# EAGLE design OSO-TIBO-B2-00 (EAGLE 9.6.2)

## Sheet 1 of 2
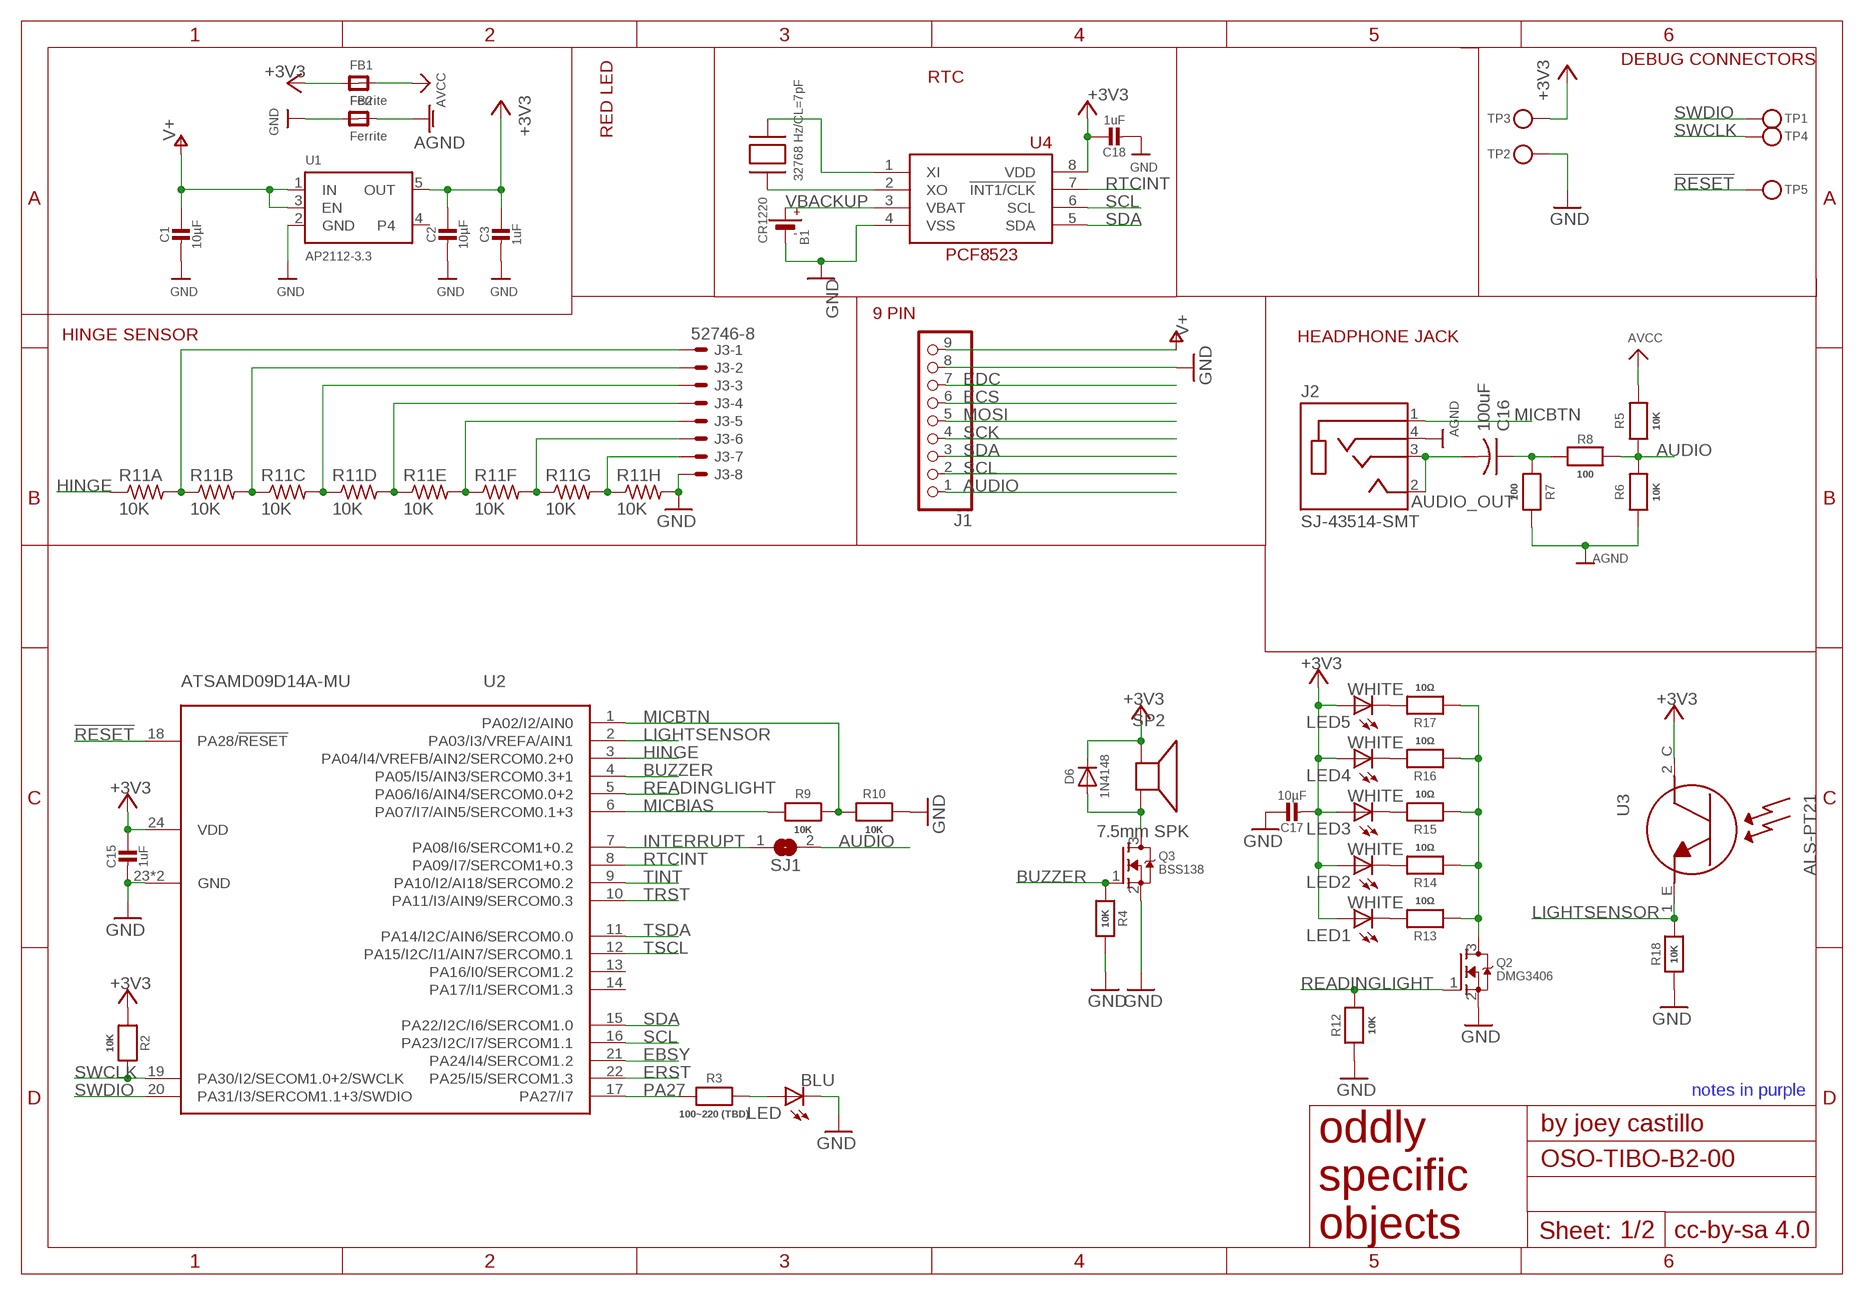
[diagram p0: schematic, sheet 1]

### Parts
B1  CR1220  BATTERYCR1220_SMT  [CR1220]
C1  10µF  CAP_CERAMIC0805-NOOUTLINE  [0805-NO]
C2  10µF  CAP_CERAMIC0805-NOOUTLINE  [0805-NO]
C3  1uF  CAP_CERAMIC0805-NOOUTLINE  [0805-NO]
C15  1uF  CAP_CERAMIC0805-NOOUTLINE  [0805-NO]
C16  100uF  C-USC1210  [C1210]
C17  10µF  CAP_CERAMIC0805-NOOUTLINE  [0805-NO]
C18  1uF  CAP_CERAMIC0805-NOOUTLINE  [0805-NO]
D6  1N4148  DIODESOD-123  [SOD-123]
FB1  Ferrite  FERRITE0805  [0805]
FB2  Ferrite  FERRITE0805  [0805]
J1  HEADER-1X9_JSTSH  [JST_SH9]
J2  SJ-43514-SMT  [CUI_SJ-43514-SMT]
J3  52746-8  [52746-8]
LED  BLU  LEDCHIPLED_0805  [CHIPLED_0805]
LED1  WHITE  LEDCHIPLED_0805  [CHIPLED_0805]
LED2  WHITE  LEDCHIPLED_0805  [CHIPLED_0805]
LED3  WHITE  LEDCHIPLED_0805  [CHIPLED_0805]
LED4  WHITE  LEDCHIPLED_0805  [CHIPLED_0805]
LED5  WHITE  LEDCHIPLED_0805  [CHIPLED_0805]
Q2  DMG3406  MOSFET-NWIDE  [SOT23-WIDE]
Q3  BSS138  MOSFET-NWIDE  [SOT23-WIDE]
R2  10K  RESISTOR0805_NOOUTLINE  [0805-NO]
R3  100~220 (TBD)  RESISTOR0805_NOOUTLINE  [0805-NO]
R4  10K  RESISTOR0805_NOOUTLINE  [0805-NO]
R5  10K  RESISTOR_0805MP  [_0805MP]
R6  10K  RESISTOR_0805MP  [_0805MP]
R7  100  RESISTOR_0805MP  [_0805MP]
R8  100  RESISTOR_0805MP  [_0805MP]
R9  10K  RESISTOR0805_NOOUTLINE  [0805-NO]
R10  10K  RESISTOR0805_NOOUTLINE  [0805-NO]
R11  10K  EXB-2HV470JV  [EXB2HV]
R12  10K  RESISTOR0805_NOOUTLINE  [0805-NO]
R13  10Ω  RESISTOR0805_NOOUTLINE  [0805-NO]
R14  10Ω  RESISTOR0805_NOOUTLINE  [0805-NO]
R15  10Ω  RESISTOR0805_NOOUTLINE  [0805-NO]
R16  10Ω  RESISTOR0805_NOOUTLINE  [0805-NO]
R17  10Ω  RESISTOR0805_NOOUTLINE  [0805-NO]
R18  10K  RESISTOR0805_NOOUTLINE  [0805-NO]
SJ1  SOLDERJUMPERREFLOW_NOPASTE  [SOLDERJUMPER_REFLOW_NOPASTE]
SP2  7.5mm SPK  SPEAKER_BUZZER5MM  [BUZZER_SMT_5MM]
TP1  TESTPOINTROUND2MMNO  [TESTPOINT_ROUND_2MM_NO]
TP2  TESTPOINTROUND2MMNO  [TESTPOINT_ROUND_2MM_NO]
TP3  TESTPOINTROUND2MMNO  [TESTPOINT_ROUND_2MM_NO]
TP4  TESTPOINTROUND2MMNO  [TESTPOINT_ROUND_2MM_NO]
TP5  TESTPOINTROUND2MMNO  [TESTPOINT_ROUND_2MM_NO]
U1  AP2112-3.3  VREG_SOT23-5  [SOT23-5]
U2  ATSAMD09D14A-MU  [QFN24_4MM]
U3  ALS-PT21  PHOTOTRANSISTOR_PT26-21C  [ALS-PT26-21C]
U4  PCF8523T  RTC_PCF8523T  [SOIC8_150MIL]
X1  32768 Hz/CL=7pF  XTAL-3.2X1.5  [XTAL3215]

### Nets
!RESET: TP5.P$1 U2.18(PA28/!RESET)
+3V3 [power]: C2.1 C3.1 C15.1 C17.2 C18.1 D6.C FB1.1 LED1.A LED2.A LED3.A LED4.A LED5.A R2.1 SP2.- TP3.P$1 U1.5(OUT) U2.24(VDD) U3.2_C(C) U4.8(VDD) ; also sheet 2
AGND: FB2.2 J2.4(RING2) R6.2 R7.1
AUDIO: J1.1 R5.2 R6.1 R8.1 SJ1.2
AUDIO_OUT: C16.2 J2.2(TIP) J2.3(RING1)
AVCC: FB1.2 R5.1
BUZZER: Q3.1(G) R4.1 U2.4(PA05/I5/AIN3/SERCOM0.3+1)
EBSY: U2.21(PA24/I4/SERCOM1.2) ; also sheet 2
ECS: J1.6 ; also sheet 2
EDC: J1.7 ; also sheet 2
ERST: U2.22(PA25/I5/SERCOM1.3) ; also sheet 2
GND [gnd]: B1.- C1.2 C2.2 C3.2 C15.2 C17.1 C18.2 FB2.1 J1.8 J3.8 LED.C Q2.2(S) Q3.2(S) R4.2 R10.2 R11.9 R12.1 R18.1 TP2.P$1 U1.2(GND) U2.23(GND) U2.THERM(GND) U4.4(VSS) ; also sheet 2
HINGE: R11.1 U2.3(PA04/I4/VREFB/AIN2/SERCOM0.2+0)
INTERRUPT: SJ1.1 U2.7(PA08/I6/SERCOM1+0.2)
LIGHTSENSOR: R18.2 U2.2(PA03/I3/VREFA/AIN1) U3.1_E(E)
MICBIAS: R9.1 U2.6(PA07/I7/AIN5/SERCOM0.1+3)
MICBTN: J2.1(SLEEVE) R9.2 R10.1 U2.1(PA02/I2/AIN0)
MOSI: J1.5 ; also sheet 2
N$1: C16.1 R7.2 R8.2
N$4: LED1.C R13.2
N$5: J3.1 R11.2 R11.16
N$6: J3.2 R11.3 R11.15
N$7: LED.A R3.2
N$8: J3.3 R11.4 R11.14
N$9: J3.4 R11.5 R11.13
N$10: J3.5 R11.6 R11.12
N$11: J3.6 R11.7 R11.11
N$12: J3.7 R11.8 R11.10
N$13: D6.A Q3.3(D) SP2.+
N$14: LED2.C R14.2
N$15: LED3.C R15.2
N$16: LED4.C R16.2
N$18: LED5.C R17.2
PA27: R3.1 U2.17(PA27/I7)
READINGLIGHT: Q2.1(G) R12.2 U2.5(PA06/I6/AIN4/SERCOM0.0+2)
READINGLIGHT_SINK: Q2.3(D) R13.1 R14.1 R15.1 R16.1 R17.1
RTCINT: U2.8(PA09/I7/SERCOM1+0.3) U4.7(!INT1/CLK)
SCK: J1.4 ; also sheet 2
SCL: J1.2 U2.16(PA23/I2C/I7/SERCOM1.1) U4.6(SCL)
SDA: J1.3 U2.15(PA22/I2C/I6/SERCOM1.0) U4.5(SDA)
SWCLK: R2.2 TP4.P$1 U2.19(PA30/I2/SECOM1.0+2/SWCLK)
SWDIO: TP1.P$1 U2.20(PA31/I3/SERCOM1.1+3/SWDIO)
TINT: U2.9(PA10/I2/AI18/SERCOM0.2) ; also sheet 2
TRST: U2.10(PA11/I3/AIN9/SERCOM0.3) ; also sheet 2
TSCL: U2.12(PA15/I2C/I1/AIN7/SERCOM0.1) ; also sheet 2
TSDA: U2.11(PA14/I2C/AIN6/SERCOM0.0) ; also sheet 2
V+ [power]: C1.1 J1.9 U1.1(IN) U1.3(EN)
VBACKUP: B1.+$1(+) B1.+$2(+) U4.3(VBAT)
XIN_RTC: U4.1(XI) X1.P$2
XOUT_RTC: U4.2(XO) X1.P$1
Unconnected: U1.4 U2.13(PA16/I0/SERCOM1.2) U2.14(PA17/I1/SERCOM1.3)

### Notes on the sheet
- RED LED
- DEBUG CONNECTORS
- RTC
- 9 PIN
- HINGE SENSOR | HEADPHONE JACK
- notes in purple

## Sheet 2 of 2
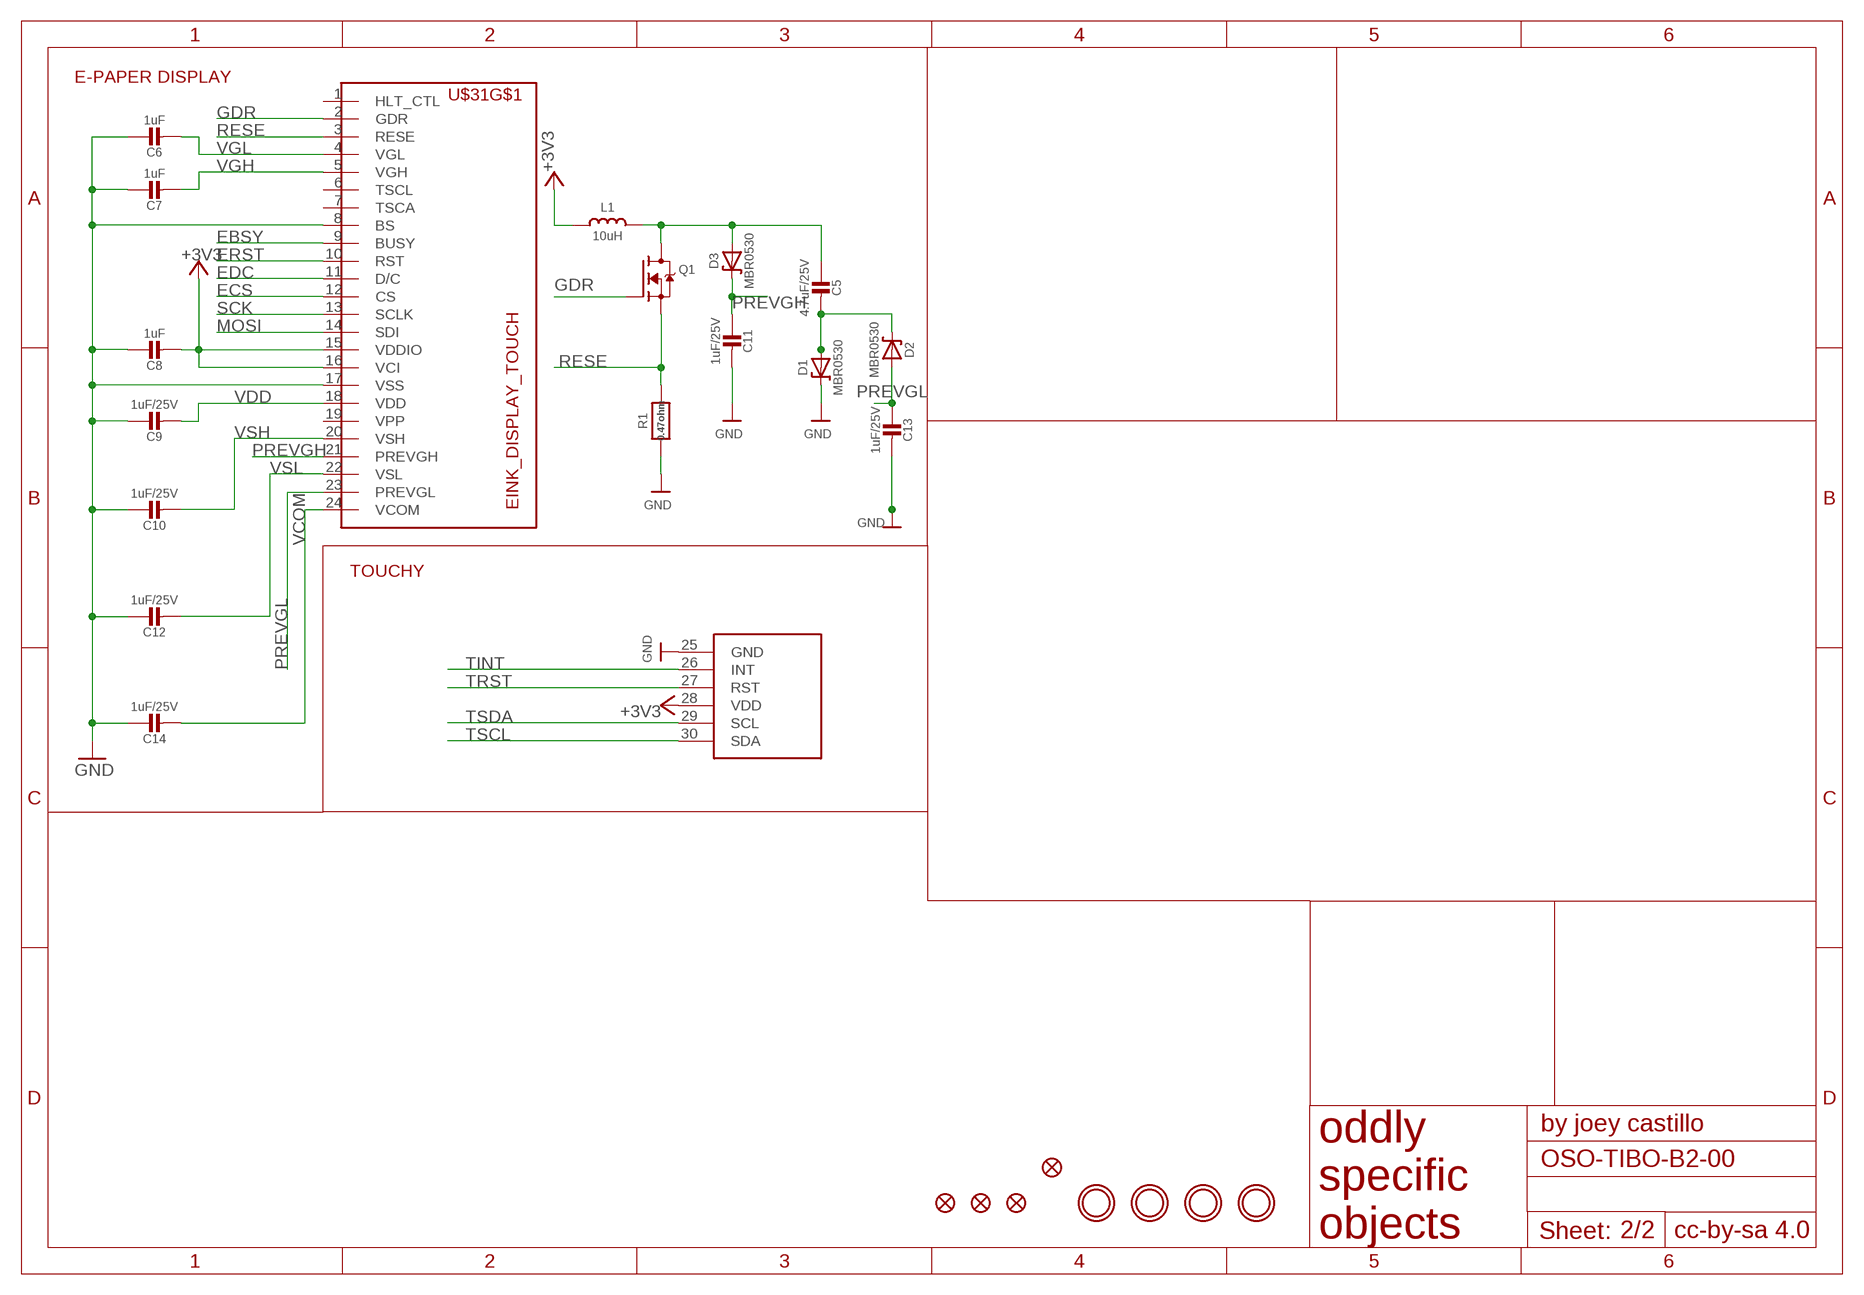
[diagram p1: schematic, sheet 2]

### Parts
C5  4.7uF/25V  CAP_CERAMIC0805-NOOUTLINE  [0805-NO]
C6  1uF  CAP_CERAMIC0805_10MGAP  [0805_10MGAP]
C7  1uF  CAP_CERAMIC0805_10MGAP  [0805_10MGAP]
C8  1uF  CAP_CERAMIC0805_10MGAP  [0805_10MGAP]
C9  1uF/25V  CAP_CERAMIC0805_10MGAP  [0805_10MGAP]
C10  1uF/25V  CAP_CERAMIC0805_10MGAP  [0805_10MGAP]
C11  1uF/25V  CAP_CERAMIC0805_10MGAP  [0805_10MGAP]
C12  1uF/25V  CAP_CERAMIC0805_10MGAP  [0805_10MGAP]
C13  1uF/25V  CAP_CERAMIC0805_10MGAP  [0805_10MGAP]
C14  1uF/25V  CAP_CERAMIC0805_10MGAP  [0805_10MGAP]
D1  MBR0530  DIODE-SCHOTTKYSOD-123  [SOD-123]
D2  MBR0530  DIODE-SCHOTTKYSOD-123  [SOD-123]
D3  MBR0530  DIODE-SCHOTTKYSOD-123  [SOD-123]
FID1  FIDUCIAL_1MM  [FIDUCIAL_1MM]
FID2  FIDUCIAL_1MM  [FIDUCIAL_1MM]
FID3  FIDUCIAL_1MM  [FIDUCIAL_1MM]
FID4  FIDUCIAL_1MM  [FIDUCIAL_1MM]
L1  10uH  MICROBUILDER_INDUCTORNR401_BIGPADS  [MICROBUILDER_INDUCTOR_4X4MM_NR401_BIGPADS]
Q1  IRLML0100  IRLML2060TRPBF  [SOT23-3]
R1  0.47ohm  RESISTOR0805_10MGAP  [0805_10MGAP]
U$1  MOUNTINGHOLE2.5  [MOUNTINGHOLE_2.5_PLATED]
U$4  MOUNTINGHOLE2.5  [MOUNTINGHOLE_2.5_PLATED]
U$5  MOUNTINGHOLE2.5  [MOUNTINGHOLE_2.5_PLATED]
U$7  MOUNTINGHOLE2.5  [MOUNTINGHOLE_2.5_PLATED]
U$31  EINK_DISPLAY_TOUCH  [EINK_DISPLAY_2_7_IN_TOUCH]

### Nets
+3V3 [power]: C8.2 L1.P$1 U$31.15(VDDIO) U$31.16(VCI) U$31.28(VDD) ; also sheet 1
EBSY: U$31.9(BUSY) ; also sheet 1
ECS: U$31.12(CS) ; also sheet 1
EDC: U$31.11(D/C) ; also sheet 1
ERST: U$31.10(RST) ; also sheet 1
GDR: Q1.1(G) U$31.2(GDR)
GND [gnd]: C6.1 C7.1 C8.1 C9.1 C10.1 C11.2 C12.1 C13.2 C14.1 D1.C R1.2 U$31.8(BS) U$31.17(VSS) U$31.25(GND) ; also sheet 1
MOSI: U$31.14(SDI) ; also sheet 1
N$2: C5.2 D1.A D2.C
N$3: C5.1 D3.A L1.P$2 Q1.3(D)
PREVGH: C11.1 D3.C U$31.21(PREVGH)
PREVGL: C13.1 D2.A U$31.23(PREVGL)
RESE: Q1.2(S) R1.1 U$31.3(RESE)
SCK: U$31.13(SCLK) ; also sheet 1
TINT: U$31.26(INT) ; also sheet 1
TRST: U$31.27(RST) ; also sheet 1
TSCL: U$31.30(SDA) ; also sheet 1
TSDA: U$31.29(SCL) ; also sheet 1
VCOM: C14.2 U$31.24(VCOM)
VDD: C9.2 U$31.18(VDD)
VGH: C7.2 U$31.5(VGH)
VGL: C6.2 U$31.4(VGL)
VSH: C10.2 U$31.20(VSH)
VSL: C12.2 U$31.22(VSL)
Unconnected: U$31.1(HLT_CTL) U$31.6(TSCL) U$31.7(TSCA) U$31.19(VPP)

### Notes on the sheet
- E-PAPER DISPLAY
- TOUCHY

## Library data of the parts
B1 = microbuilder:BATTERY: CR1220 SMT - Digikey: 3001K-ND CD2032 BAT-HLD-001 - Digikey: BAT-HLD-001-ND
C1-C3 C5-C15 C17 C18 = microbuilder:CAP_CERAMIC: Ceramic Capacitors For new designs, use the packages preceded by an '_' character since they are more reliable: The following footprints should be used on most boards: _0402 - Standard footprint for regular board layouts _0603 - Standard footprint for regular board layouts _0805 - Standard footprint for regular board layouts _1206 - Standard footprint for regular board layouts For extremely tight-pitch boards where space is at a premium, the following 'micro-pitch' footprints can be used (smaller pads, no silkscreen outline, etc.): _0402MP - Micro-pitch footprint for very dense/compact boards _0603MP - Micro-pitch footprint for very dense/compact boards _0805MP - Micro-pitch footprint for very dense/compact boards _1206MP - Micro-pitch footprint for very dense/compact boards
C16 = resistor:C-US: CAPACITOR, American symbol
D1-D3 = microbuilder:DIODE-SCHOTTKY
D6 = microbuilder:DIODE: Diode SMA Model Volts Amps Type Vf Ir Digikey # Notes SSA34-E3 40V 3A Schottky 480mV @ 3A 200uA @ 40V SSA34-E3/61TGITR-ND CDBA120-G 20V 1A Schottky 500mV @ 1A 500uA @ 20V 641-1014-6-ND REEL MBRA210 10V 2A Schottky 350mV @ 2A 700uA @ 10V MBRA210LT3 SOD-123 Model Volts Amps Type Vf Ir Order # Notes BAT54T1G 30V 200mA Schottky 800mV @ 200mA 2uA @ 25V BAT54T1GOSTR-ND B0530W 30V 500mA Schottky 430mV @ 500mA 130uA @ 30V B0530W-FDICT-ND REEL MBR120 20V 1A Schottky 340mV @ 1A MBR120VLSFT1GOSCT-ND SOD-323 Model Volts Amps Type Vf Ir Order # Notes PMEG2005EJ 20V 500mA Schottky 355mV @ 500mA 568-4110-1-ND ZLLS410 10V 570mA Schottky 380mV @ 570mA ZLLS410CT-ND 1N4148WS 75V 150mA Silicon/Simple 1V 1N4148WSFSCT-ND REEL SOD-523 Model Volts Amps Type Vf Ir Order # Notes BAT54XV2 30V 200mA Schottky 0.8V @ 100mA BAT54XV2CT-ND TB751S 30V 30mA Schottky RB751S-40TE61CT-ND SOT23-R/W (R = Solder Paste/Reflow Ovens, W = Hand-Soldering) Model Volts Amps Type Vf Ir Order # Notes BAT54FILM 40V 300mA Schottky 497-7162-1-ND POWERDI-5 Model Volts Amps Type Vf Ir Order # Notes PDS560 60V 5A Schottky 670mV @ 5A 150uA @ 60V PDS560DICT-ND
FB1 FB2 = microbuilder:FERRITE: Ferrite Bead 0603 MMZ1608B121C - 120 Ohm @ 100MHz, 600mA, 0.15 Ohm DC Resistance - Digikey: 445-2164-1-ND BK1608HW121-T - 120 Ohm, 600mA Ferrite Chip - Digikey: 587-1876-2-ND 0805 HZ0805B272R-10 - 2.7K Ohm @ 100MHz, 200mA, 0.8 Ohm DC Resistance - Digikey: 240-2504-1-ND (see also Murata BLM21BD272SN1L) MMZ2012Y152B - 1.5K Ohm @ 100MHz, 500mA, 0.4 Ohm DC Resistance - Digikey: 445-1560-1-ND - Mainly for high frequency (80-400MHz) MMZ2012R102A - 1K Ohm @ 100MHz, 500mA, 0.3 Ohm DC Resistance - Digikey: 445-1555-2-ND - More general purpose (10-200MHz)
FID1-FID4 = microbuilder:FIDUCIAL: Fiducial Alignment Points Various fiducial points for machine vision alignment.; BOM: EXCLUDE
J1 = My Stuff:HEADER-1X9: PIN HEADER
J2 = SJ-43514-SMT:SJ-43514-SMT: 4 conductor 3.5 mm Surface Mount Audio Jack; CUI_PURCHASE_URL: https://www.cui.com/product/interconnect/connectors/audio-connectors/jacks/sj-4351x-smt-series?utm_source=snapeda.com&utm_medium=referral&utm_campaign=snapedaBOM; DESCRIPTION: 3.5 mm, 4 Conductors, Right Angle, Surface Mount _SMT_, Audio Jack Connector; DIGI-KEY_PART_NUMBER: CP-43514SJCT-ND; DIGI-KEY_PURCHASE_URL: https://www.digikey.com/product-detail/en/cui-inc/SJ-43514-SMT-TR/CP-43514SJCT-ND/669734?utm_source=snapeda&utm_medium=aggregator&utm_campaign=symbol; MF: CUI Inc.; MP: SJ-43514-SMT-TR; PACKAGE: None
J3 = con-molex:52746-8: FPC Connector ZIF for SMT 0.5mm Source: http://www.farnell.com/datasheets/73044.pdf [DWG. NO. (Sheet 1 OF 2) SD-52746-**17]; MF: MOLEX; OC_FARNELL: unknown; OC_NEWARK: unknown
L1 = Adafruit 3.5in 480x320 FeatherWing:MICROBUILDER_INDUCTOR: Inductors 0603: 10nH Ceramic Inductor - microwire antenna/RF (Digikey: 712-1434-2-ND) 0805: 560nH Ceramic Inductor - RF (Digikey: 553-1047-1-ND) 270nH Ceramic Inductor - Q = 40@250MHz, +-5%, 1 Ohm DC Resistance (Digikey: 535-10506-2-ND) 1007 (2518 Metric) SMT: 10µH 10% 250mOhm 820mA 1007 Inductor (Digikey: 587-2189-1-ND) 22µH 10% 500mOhm 580mA 1007 Inductor (Digikey: 587-2190-1-ND) 47µH 10% 950mOhm 420mA 1007 Inductor (Digikey: 587-2191-1-ND) 47µH 5% 100mOhm 1A 1008 Inductor (Digikey: 732-1816-1-ND) 5.0x5.0mm (Taiyo Yuden NR5040 Series) 6.8µH 20% 2.3A 64mOhm Inductor (Digikey: 587-2374-2-ND) 5.0x5.0mm (TDK VLC5045 Series) 4.7µH 20% 3.3A 34mOhm Inductor (Digikey: 445-6526-1-ND) 6.8µH 20% 2.7A 46mOhm Inductor (Digikey: 445-6527-1-ND) 6.0x6.0mm (TDK VLC6045 Series) 4.7µH 20% 3.8A 27mOhm Inductor (Digikey: 445-6538-2-ND) 6.8µH 20% 3A 41mOhm Inductor (Digikey: 445-6540-1-ND) 6.2µH 30% 2.2A 45mOhm Inductor (Digikey: SRR5028-6R2YCT-ND) - Not TDK VLC6045 but footprint should match 6.0x6.0mm (TDK SLF6045 Series) 6.8uH 30% 2A 33mOhm Inductor (Digikey: 445-4572-1-ND, Mouser: 810-SLF645T6R8N2R0PF) 6.0x6.0mm (Sumida CDRH5D28 Series) 6.2uH 30% 1.8A 45mOhm Inductor (Digikey: 308-1542-1-ND) Taiyo Yuden NR3015T2R2M - 2.2uH 20% 1.5A (Digikey: 587-1648-2-ND, Mouser: 963-NR3015T2R2M) - Used with TI TPS62172 CoilCraft RFID Transponder Coil - MA5532-AE (For use with AS3935 Lightning Sensor) Taiyo Yuden NRH2412T2R2MNGH - 2.2uH 20% 1AA (Digikey: 587-3443-1-ND) - Used with TI LM3671 Vishay IHLP 1.0uH Molded Inductor - 24mOhm DCR, 5A, +/-20%, -55°C-125°C (Digikey: 541-1319-1-ND)
LED LED1-LED5 = adafruit:LED: LED OSRAM: - CHIPLED LG R971, LG N971, LY N971, LG Q971, LY Q971, LO R971, LY R971 LH N974, LH R974 LS Q976, LO Q976, LY Q976 LO Q996 - Hyper CHIPLED LW Q18S LB Q993, LB Q99A, LB R99A - SideLED LS A670, LO A670, LY A670, LG A670, LP A670 LB A673, LV A673, LT A673, LW A673 LH A674 LY A675 LS A676, LA A676, LO A676, LY A676, LW A676 LS A679, LY A679, LG A679 - Hyper Micro SIDELED® LS Y876, LA Y876, LO Y876, LY Y876 LT Y87S - SmartLED LW L88C, LW L88S LB L89C, LB L89S, LG L890 LS L89K, LO L89K, LY L89K LS L896, LA L896, LO L896, LY L896 - TOPLED LS T670, LO T670, LY T670, LG T670, LP T670 LSG T670, LSP T670, LSY T670, LOP T670, LYG T670 LG T671, LOG T671, LSG T671 LB T673, LV T673, LT T673, LW T673 LH T674 LS T676, LA T676, LO T676, LY T676, LB T676, LH T676, LSB T676, LW T676 LB T67C, LV T67C, LT T67C, LS T67K, LO T67K, LY T67K, LW E67C LS E67B, LA E67B, LO E67B, LY E67B, LB E67C, LV E67C, LT E67C LW T67C LS T679, LY T679, LG T679 LS T770, LO T770, LY T770, LG T770, LP T770 LB T773, LV T773, LT T773, LW T773 LH T774 LS E675, LA E675, LY E675, LS T675 LS T776, LA T776, LO T776, LY T776, LB T776 LHGB T686 LT T68C, LB T68C - Hyper Mini TOPLED® LB M676 - Mini TOPLED Santana® LG M470 LS M47K, LO M47K, LY M47K Source: http://www.osram.convergy.de/
Q1 = Parts:IRLML2060TRPBF
Q2 Q3 = microbuilder:MOSFET-N: N-Channel Mosfet LEGEND VDS: Voltage Drain-Source ID: Drain Current RDS(ON): Drain-Source On-State Resistance VGS(TH): Gate-Source Threshold Voltage CISS: Drain-Source Input Capacitance SOT-23 Name VDS ID RDS(ON) VGS(TH) CISS Order Number 2N7002E 60V 260mA 2.5 Ohm 2.5V @ 250uA 26.7pF @ 25V 2N7002ET1GOSTR-ND BSH103 30V 850mA 400 mOhm 400mV @ 1mA 83pF @ 24V BSH103,235-ND BSS138 60V 320mA 1.6 Ohm 1.5V @ 250uA 50pF @ 10V Mouser: 771-BSS138PW115 DMN2075U-7 20V 4.2A 38 mOhm 1V @ 250 uA 594.3pF @ 10V DMN2075U-7DICT-ND * BSS138 good choice for I2C level-shifting POWERPAK 1212-8 Name VDS ID RDS(ON) VGS(TH) CISS Order Number Si7308DN 60V 6A 58 mOhm 3V @ 250uA 665pF @ 15V SI7308DN-T1-E3CT-ND
R1-R10 R12-R18 = microbuilder:RESISTOR: Resistors For new designs, use the packages preceded by an '_' character since they are more reliable: The following footprints should be used on most boards: _0402 - Standard footprint for regular board layouts _0603 - Standard footprint for regular board layouts _0805 - Standard footprint for regular board layouts _1206 - Standard footprint for regular board layouts For extremely tight-pitch boards where space is at a premium, the following 'micro-pitch' footprints can be used (smaller pads, no silkscreen outline, etc.): _0402MP - Micro-pitch footprint for very dense/compact boards _0603MP - Micro-pitch footprint for very dense/compact boards _0805MP - Micro-pitch footprint for very dense/compact boards _1206MP - Micro-pitch footprint for very dense/compact boards
R11 = EXB2HV470JV:EXB-2HV470JV; BUILT_BY: EMA_UL_Team; MANUFACTURER_PART_NUMBER: EXB-2HV470JV; VENDOR: Panasonic
SJ1 = OSO-VOCA-A1-00:SOLDERJUMPER: SMD Solder JUMPER Solder the two pads together to create a connection, or remove the solder to break it. REFLOW - Use this footprint for solder paste and reflow ovens. WAVE - Use this footprint for hand-soldering (larger pads). CLOSED - Has a trace between the two pads to ensure it is closed by default. The trace needs to be cut to disable the jumper, and can be closed again by creating a solder bridge between the two pads.; BOM: EXCLUDE
SP2 = microbuilder:SPEAKER: SPEAKER Source: Buerklin Added PS12 (for part # PS1240 piezo) http://www.ladyada.net/library/pcb/eaglelibrary.html
TP1-TP5 = microbuilder:TESTPOINT: Test Point Various test points for characterisation and PCB testing TESTPOINT_SMT - Compact Surface Mount Test Point [Digikey: 5016KTR-ND]
U1 = microbuilder:VREG_SOT23-5: SOT23-5 Fixed Voltage Regulators Part Current Out V Out V In V Dropout θJA (°C/W) TJ (°C) Digikey Part No. ADP121 150mA 3.3V 3.4-5.5V 0.09V @ 150mA -- -- ADP121-AUJZ33R7CT-ND ADP121 150mA 3.0V 3.1-5.5V 0.09V @ 150mA -- -- ADP121-AUJZ30R7CT-ND ADP122 300mA 3.3V 3.4-5.5V 0.085V @ 300mA -- -- ADP122AUJZ-3.3-R7CT-ND ADP1712 300mA 3.3V 3.5-5.5V 0.17V @ 300mA -- -- ADP1712AUJZ-3.3-R7TR-ND AP7311 (Low Cost) 150mA 3.3V 3.5-6V 0.15V @ 150mA -- -- AP7311-33WG-7DICT-ND LD39015M18R 150mA 1.8V 1.9V-5.5V 0.08V @ 100mA -- -- 497-6977-1-ND LP2985A-33DBVR 150mA 3.3V 3.3-16V 0.28V @ 150mA 206 150 296-18479-1-ND MCP1824T-3302E/OT 300mA 3.3V 3.5V-6V 0.2V @ 300mA -- -- MCP1824T-3302E/OTCT-ND MIC5205-2.5YM5 TR 150mA 2.5V 2.7-16V 0.165V @ 150mA -- -- 576-1257-2-ND MIC5205-3.0YM5 TR 150mA 3.0V 3.2V-16V 0.165V @ 150mA -- -- 576-1258-2-ND MIC5205-3.3YM5 TR 150mA 3.3V 3.5V-16V 0.165V @ 150mA -- -- 576-1259-2-ND TPS780330220 150mA 3.3V+2.2V 3.6-5.5V 250mV Max -- -- 296-23332-1-ND TDA3663/N1,135 100mA 3.3V 3.5-45V 0.18V @ 50mA -- -- 568-5343-1-ND Max operating temp can be calculated using θJA, TJ (max junction temperature), and power in watts. Set the "Maximum Ambient Temperature" until it reaches TJ ("Max Junction Temperature"), which is the absolute limit for safe use of the regulator: Heat Sink Temperature Calculator <http://www.daycounter.com/Calculators/Heat-Sink-Temperature-Calculator.phtml> For example, With 12V source into a 3.3V LP2985 and a 30mA load, we are dissipating (12V-3.3V) * 0.03A = 0.261W. With a θJA of 206 °C/W, a TJ of 150°C, and 261mW we can safely use the chip without a heat sink up to 75°C (=147.1°C Junction Temperature).
U2 = Adafruit MONSTER M4SK:ATSAMD09D14A
U3 = microbuilder:PHOTOTRANSISTOR: ALS-PT19-315C - Analog Light Sensor VCC: 2.5-5.5V
U4 = microbuilder:RTC_PCF8523
U$1 U$4 U$5 U$7 = microbuilder:MOUNTINGHOLE: Mounting Hole For #2 screws (0.086"/2.18mm width, 0.094"/2.4mm hole) use 2.5mm; BOM: EXCLUDE
U$31 = My Stuff:EINK_DISPLAY_TOUCH
X1 = adafruit:XTAL: Low cost SMT crystals, no capacitors included http://www.ladyada.net/library/eagle

## Net classes
0 default: width 0.152 mm, drill 0.254 mm
1 power: width 0.305 mm, drill 0.305 mm

## Board
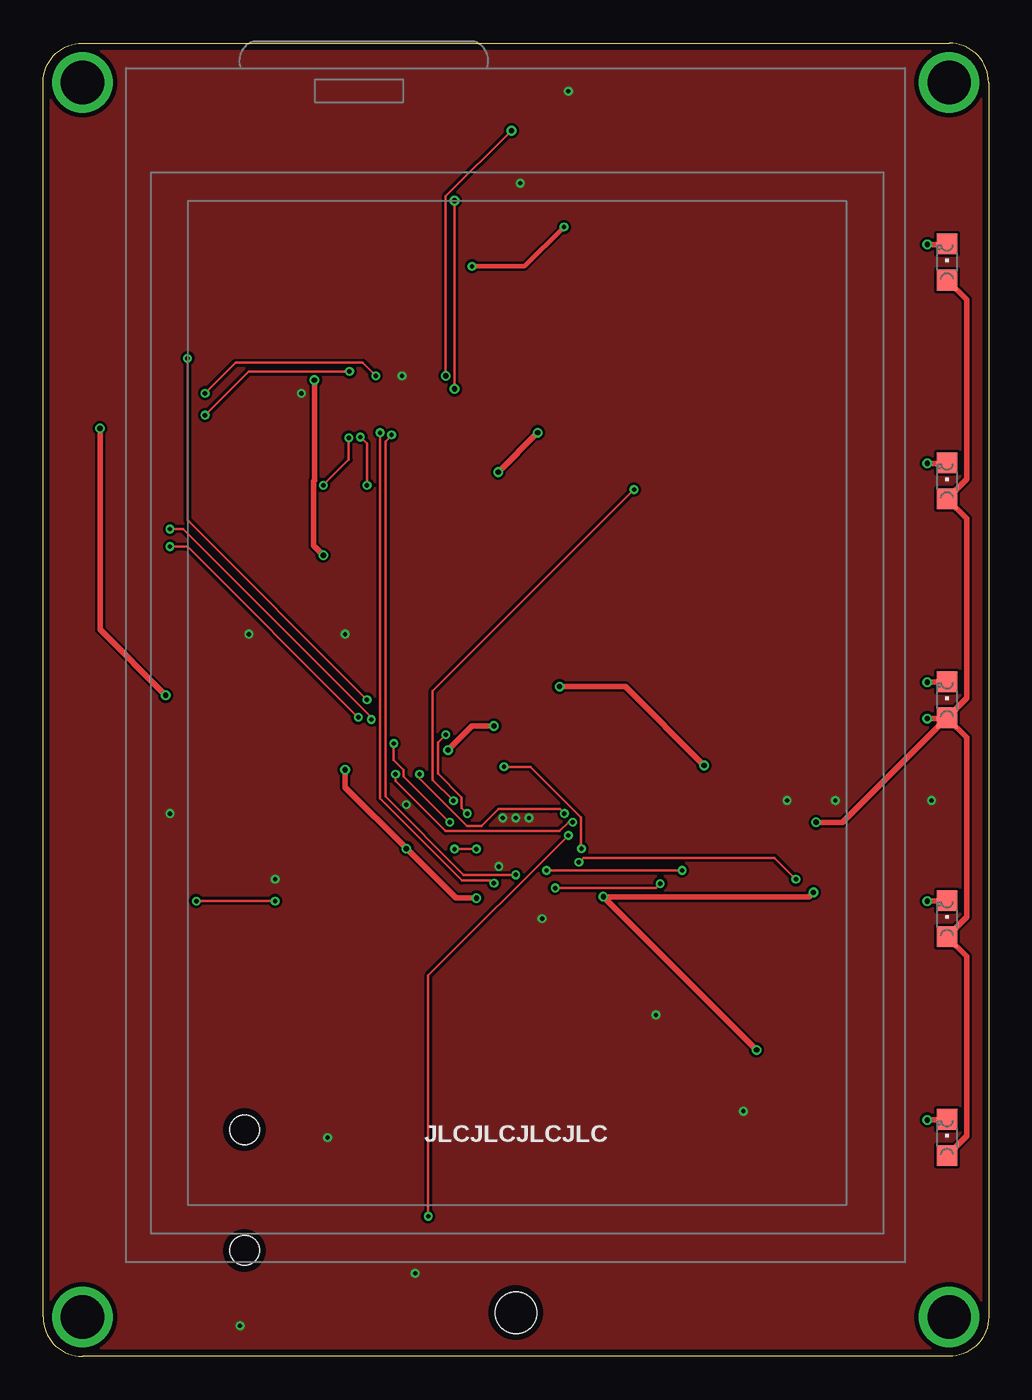
[diagram p2: board, top side]
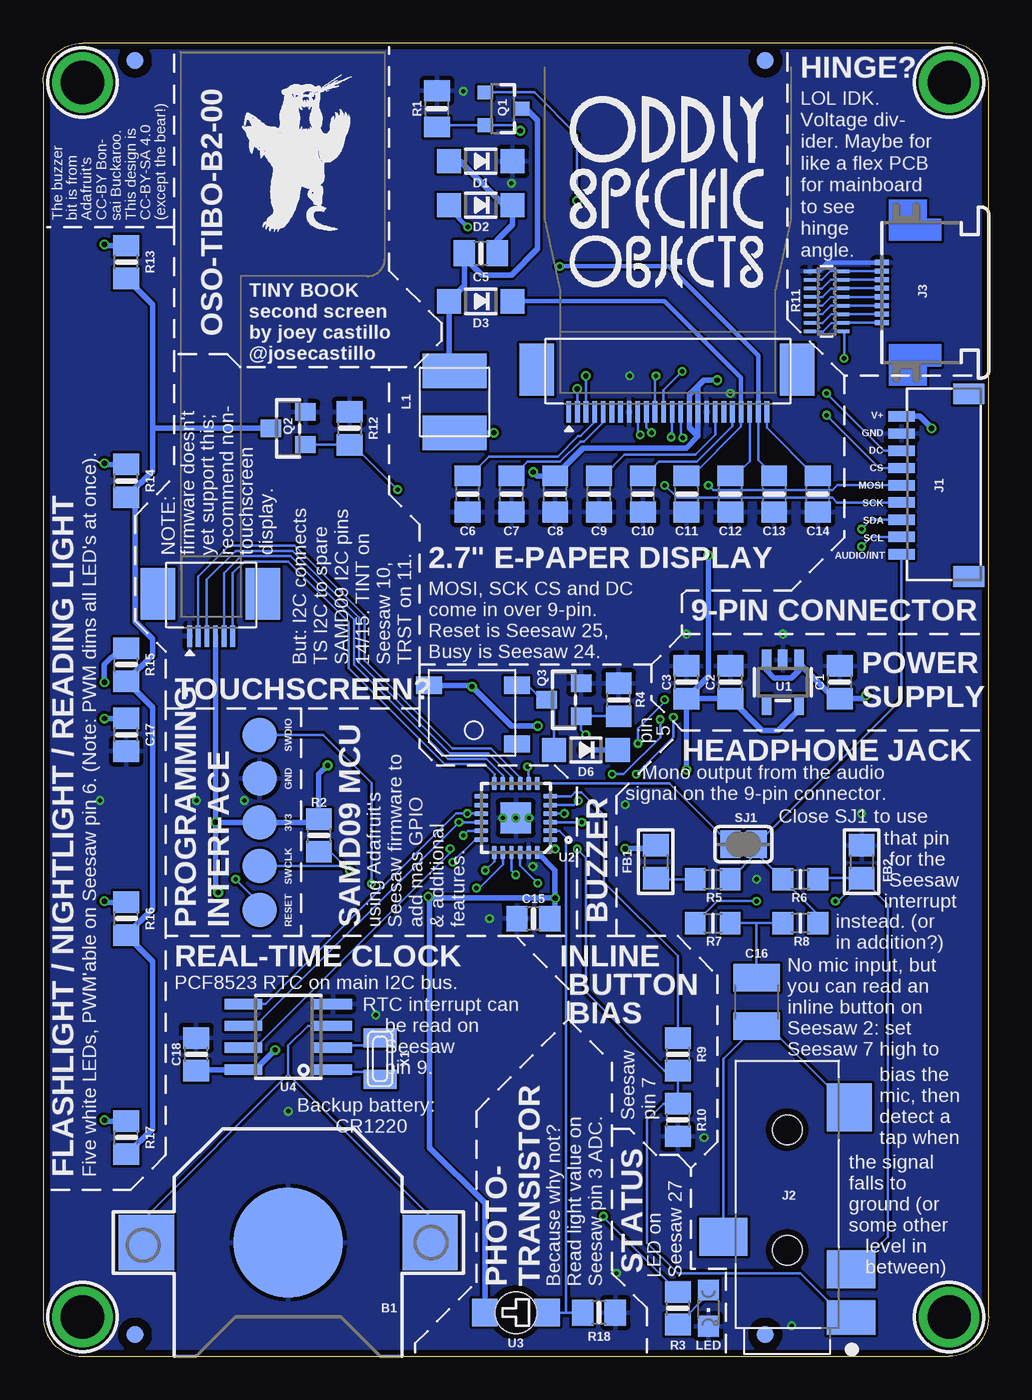
[diagram p3: board, bottom side, seen from below]

Size 54.86 x 76.2 mm. Coordinates in mm from the lower left corner, seen from the top.
Outline: 54.86,73.91 54.86,2.29 arc-90 52.58,0 2.29,0 arc-90 0,2.29 0,73.91 arc-90 2.29,76.2 52.58,76.2 arc-90 54.86,73.91
Copper layers (1*16): Top 0.035559375mm / dielectric 1.6mm / Bottom 0.035559375mm
Design rules "oshpark-2layer *": minimum track width 6mil, minimum drill 10mil, track to track 6mil, track to pad 6mil, pad to pad 6mil, via to via 6mil, smd to smd 6mil, copper to edge 15mil, drill to drill 6mil, minimum pad ring 5mil, minimum via ring 5mil, stop-mask expansion 2.5mil, vias tented up to drill 12mil, thermal gap 10mil

### Footprints (pad centres in the part's own frame; a part is rotated, then mirrored left to right if it is on the bottom)
CR1220 = smd 3.2 x 3.2: +$1 -8.225,0; +$2 8.225,0 | smd 6.35 x 6.35: - 0,0
0805-NO = smd 1.24 x 1.5: 1 -0.95,0; 2 0.95,0
0805_10MGAP = smd 1.2 x 1.5: 1 -1.05,0; 2 1.05,0
C1210 = smd 1.6 x 2.7: 1 -1.4,0; 2 1.4,0
SOD-123 = smd 1.4 x 1.4: A 1.85,0; C -1.85,0
0805 = smd 1.3 x 1.5: 1 -0.95,0; 2 0.95,0
FIDUCIAL_1MM = smd 1 x 1: 1 0,0
JST_SH9 = smd 0.6 x 1.55: 1 -4,2.514; 2 -3,2.514; 3 -2,2.514; 4 -1,2.514; 5 0,2.514; 6 1,2.514; 7 2,2.514; 8 3,2.514; 9 4,2.514 | smd 1.2 x 1.8: MT1 -5.3,-1.386; MT2 5.3,-1.386
CUI_SJ-43514-SMT = smd 2 x 2.8: 1 -7.15,-3.7 | smd 2.8 x 2.6: 2 5.05,-3.6 | smd 2.2 x 2.8: 3 -2.45,3.7; 4 -4.35,-3.7 | hole 1.7: -3.25,0; 3.75,0
52746-8 = smd 0.3 x 0.8: 1 -1.75,0.6; 2 -1.25,0.6; 3 -0.75,0.6; 4 -0.25,0.6; 5 0.25,0.6; 6 0.75,0.6; 7 1.25,0.6; 8 1.75,0.6
MICROBUILDER_INDUCTOR_4X4MM_NR401_BIGPADS = smd 2 x 3.7: P$1 -1.8,0; P$2 1.8,0
CHIPLED_0805 = smd 1.2 x 1.2: A 0,-1.05; C 0,1.05
SOT23-3 = smd 0.8 x 0.9: 1 -0.95,-1; 2 0.95,-1; 3 0,1.1
SOT23-WIDE = smd 1 x 1.2: 1 -0.95,-1; 2 0.95,-1; 3 0,1
_0805MP = smd 1.2 x 1.3: 1 -1.016,0; 2 1.016,0
EXB2HV = smd 0.686 x 0.203: 1 -0.965,1.75; 2 -0.965,1.25; 3 -0.965,0.75; 4 -0.965,0.25; 5 -0.965,-0.25; 6 -0.965,-0.75; 7 -0.965,-1.25; 8 -0.965,-1.75; 9 0.965,-1.75; 10 0.965,-1.25; 11 0.965,-0.75; 12 0.965,-0.25; 13 0.965,0.25; 14 0.965,0.75; 15 0.965,1.25; 16 0.965,1.75
SOLDERJUMPER_REFLOW_NOPASTE = smd 1.168 x 1.6: 1 -0.762,0; 2 0.762,0
BUZZER_SMT_5MM = smd 1.5 x 1: + -2.6,-1.6; - 2.5,-1.6; MT -2.6,1.8
TESTPOINT_ROUND_2MM_NO = smd 2 x 2: P$1 0,0
SOT23-5 = smd 0.55 x 1.2: 1 -0.95,-1.3; 2 0,-1.3; 3 0.95,-1.3; 4 0.95,1.3; 5 -0.95,1.3
QFN24_4MM = smd 0.8 x 0.28: 1 -2,1.25; 2 -2,0.75; 3 -2,0.25; 4 -2,-0.25; 5 -2,-0.75; 6 -2,-1.25; 13 2,-1.25; 14 2,-0.75; 15 2,-0.25; 16 2,0.25; 17 2,0.75; 18 2,1.25 | smd 0.28 x 0.8: 7 -1.25,-2; 8 -0.75,-2; 9 -0.25,-2; 10 0.25,-2; 11 0.75,-2; 12 1.25,-2; 19 1.25,2; 20 0.75,2; 21 0.25,2; 22 -0.25,2; 23 -0.75,2; 24 -1.25,2 | smd 1.778 x 1.778: THERM 0,0
ALS-PT26-21C = smd 1.5 x 1.6: 1_E -1.8,0; 2_C 1.8,0 | hole 2.4: 0,0
SOIC8_150MIL = smd 0.6 x 2.2: 1 -1.905,-2.6; 2 -0.635,-2.6; 3 0.635,-2.6; 4 1.905,-2.6; 5 1.905,2.6; 6 0.635,2.6; 7 -0.635,2.6; 8 -1.905,2.6
MOUNTINGHOLE_2.5_PLATED = drill 2.5 pad 3.2: P$1 0,0
EINK_DISPLAY_2_7_IN_TOUCH = smd 1.25 x 0.275 bottom: 1 19.88,-25.679; 2 19.88,-26.179; 3 19.88,-26.679; 4 19.88,-27.179; 5 19.88,-27.679; 6 19.88,-28.179; 7 19.88,-28.679; 8 19.88,-29.179; 9 19.88,-29.679; 10 19.88,-30.179; 11 19.88,-30.679; 12 19.88,-31.179; 13 19.88,-31.679; 14 19.88,-32.179; 15 19.88,-32.679; 16 19.88,-33.179; 17 19.88,-33.679; 18 19.88,-34.179; 19 19.88,-34.679; 20 19.88,-35.179; 21 19.88,-35.679; 22 19.88,-36.179; 23 19.88,-36.679; 24 19.88,-37.179; 25 32.88,-3.679; 26 32.88,-4.179; 27 32.88,-4.679; 28 32.88,-5.179; 29 32.88,-5.679; 30 32.88,-6.179 | smd 3 x 2 bottom: SPRT1 17.42,-23.829; SPRT2 17.42,-38.939; SPRT3 30.42,-1.829; SPRT4 30.42,-7.939
XTAL3215 = smd 1.1 x 1.9: P$1 1.2,0; P$2 -1.2,0

### Placement (x,y rotation side)
B1  40.64,6.6 180 bottom
C1  8.64,39.12 90 bottom
C2  14.99,39.12 90 bottom
C3  17.53,39.12 90 bottom
C5  29.46,64.01 0 bottom
C6  30.23,50.04 90 bottom
C7  27.69,50.04 90 bottom
C8  25.15,50.04 90 bottom
C9  22.61,50.04 90 bottom
C10  20.07,50.04 90 bottom
C11  17.53,50.04 270 bottom
C12  14.99,50.04 90 bottom
C13  12.45,50.04 270 bottom
C14  9.91,50.04 90 bottom
C15  26.42,25.4 180 bottom
C16  13.46,20.57 270 bottom
C17  50.04,36.07 90 bottom
C18  45.97,17.53 90 bottom
D1  29.46,69.34 180 bottom
D2  29.46,66.8 180 bottom
D3  29.46,61.21 180 bottom
D6  23.37,35.18 180 bottom
FB1  19.3,28.7 270 bottom
FB2  7.37,28.7 270 bottom
FID1  49.53,75.18 90 bottom
FID2  12.95,75.18 270 bottom
FID3  49.53,1.27 90 bottom
FID4  12.95,1.27 270 bottom
J1  2.54,50.55 90 bottom
J2  11.68,9.4 90 bottom
J3  5.59,61.72 90 bottom
L1  30.99,55.37 90 bottom
LED  16.26,2.79 180 bottom
LED1  52.45,63.5 0 top
LED2  52.45,50.8 0 top
LED3  52.45,38.1 0 top
LED4  52.45,25.4 0 top
LED5  52.45,12.7 0 top
Q1  28.19,72.39 270 bottom
Q2  40.64,53.85 90 bottom
Q3  24.64,38.1 90 bottom
R1  32,72.39 90 bottom
R2  38.86,30.23 270 bottom
R3  18.03,2.79 270 bottom
R4  21.46,38.1 90 bottom
R5  16,27.69 0 bottom
R6  10.92,27.69 0 bottom
R7  16,25.15 0 bottom
R8  10.92,25.15 180 bottom
R9  18.03,17.53 270 bottom
R10  18.03,13.72 270 bottom
R11  9.4,61.21 180 bottom
R12  37.08,53.85 270 bottom
R13  50.04,63.5 90 bottom
R14  50.04,50.8 90 bottom
R15  50.04,40.13 90 bottom
R16  50.04,25.4 90 bottom
R17  50.04,12.7 90 bottom
R18  22.61,2.54 180 bottom
SJ1  14.22,29.72 0 bottom
SP2  29.97,37.34 180 bottom
TP1  42.29,36.07 270 bottom
TP2  42.29,33.53 270 bottom
TP3  42.29,30.99 270 bottom
TP4  42.29,28.45 270 bottom
TP5  42.29,25.91 270 bottom
U1  11.94,39.12 180 bottom
U2  27.43,31.24 180 bottom
U3  27.43,2.54 180 bottom
U4  40.64,18.54 90 bottom
U$1  2.29,73.91 90 bottom
U$4  2.29,2.29 90 bottom
U$5  52.58,73.91 90 bottom
U$7  52.58,2.29 90 bottom
U$31  50.04,74.68 270 top
U$37  [OSO_WORDMARK_THREELINE_450MIL_1000DPI]  18.67,67.56 0 bottom
U$44  [OSO_BEAR_250X360MIL_1000DPI]  40.13,69.85 0 bottom
X1  35.31,17.27 90 bottom

### Tracks (layer width: path | path; a pad name or v marks a point on that pad's centre or on a via)
!RESET  (via drill 0.25)
  Top 0.152: v31.09,28.68 31.35,28.93 42.44,28.93 v43.69,27.69
  Bottom 0.152: U2.18 29.78,29.99 v31.09,28.68 | v43.69,27.69 42.29,26.29 TP5.P$1
+3V3  (via drill 0.3)
  Top 0.305: v17.53,34.04 17.53,33.02 v21.08,29.46 23.95,26.59 v25.15,26.59 | v15.75,56.64 15.75,50.83 15.7,50.78 15.7,47.04 v16.26,46.48 | v44.7,26.92 44.45,26.67 v32.51,26.67 v41.4,17.78 | v26.42,51.31 v28.7,53.59 | LED1.A 53.59,61.31 53.59,50.89 LED2.A 53.59,48.61 53.59,38.19 LED3.A | LED3.A 53.59,35.91 53.59,25.49 LED4.A 53.59,23.21 53.59,12.79 LED5.A | v44.86,30.99 46.39,30.99 52.4,37 | 52.4,37 LED3.A | v51.31,37.01 v51.31,37 52.4,37 | v38.35,34.29 33.78,38.86 v29.97,38.86 | v26.16,36.58 24.89,36.58 v23.5,35.18
  Bottom 0.305: 16.86,53.39 17.55,52.7 23.53,52.7 C8.2 26.2,51.09 v26.42,51.31 | 16.86,53.39 U$31.16 16.86,56.29 | 16.86,53.39 17.36,53.89 U$31.15 17.36,55.79 16.86,56.29 | U1.5 10.99,37.53 12.19,36.32 13.14,36.32 C2.1 C3.1 | v17.53,34.04 C3.1 | v21.08,29.46 19.49,29.46 FB1.1 | v25.15,26.59 25.15,28.21 U2.24 | C3.1 16.26,39.44 v16.26,46.48 | v15.75,56.64 16.51,56.64 16.86,56.29 | C15.1 25.15,25.72 v25.15,26.59 | v25.15,26.59 32.44,26.59 | 32.44,26.59 v32.51,26.67 | U$31.28 v44.86,30.99 | v44.86,30.99 44.86,27.08 v44.7,26.92 | v28.7,53.59 28.72,53.57 L1.P$1 | v41.4,17.78 v41.41,17.78 42.55,16.64 U4.8 45.72,16.64 45.78,16.58 C18.1 | v44.86,30.99 TP3.P$1 39.05,30.99 R2.1 38.86,33.78 v38.35,34.29 | C17.2 51.3,37.02 v51.31,37.01 | U3.2_C 29.23,8.91 32.44,12.12 32.44,26.59 | SP2.- 30.05,38.94 v29.97,38.86 27.69,36.58 v26.16,36.58 | v23.5,35.18 D6.C
AGND  (via drill 0.25)
  Top 0.152: v13.46,26.42 v8.89,26.42
  Bottom 0.152: FB2.2 9.84,27.75 R6.2 | FB2.2 5.84,26.23 5.84,6.94 7.73,5.05 J2.4 | R7.1 15.75,26.42 v13.46,26.42 | FB2.2 8.7,26.42 v8.89,26.42
AUDIO
  Bottom 0.152: J1.1 5.05,38.13 SJ1.2 13.46,29.21 | 13.46,29.21 13.21,29.46 13.21,28.96 R6.1 9.91,25.65 R8.1 | 13.46,29.21 R5.2
AUDIO_OUT
  Bottom 0.152: J2.2 12.81,19.17 C16.2 15.38,17.25 J2.3
AVCC
  Bottom 0.152: FB1.2 19.24,27.69 R5.1
BUZZER  (via drill 0.25)
  Top 0.152: v24.61,31.5 24.29,31.82 24.29,32.44 22.91,33.83 22.91,35.61 v23.37,36.07
  Bottom 0.152: R4.1 Q3.1 23.64,36.34 v23.37,36.07 | U2.4 v24.62,31.49 v24.61,31.5
EBSY  (via drill 0.25)
  Top 0.152: v20.22,53.47 20.22,53.45 19.86,53.09 19.86,32.49 24.41,27.94 v27.43,27.94
  Bottom 0.152: U$31.9 20.36,53.61 v20.22,53.47 | v27.43,27.94 27.68,28.19 U2.21
ECS  (via drill 0.25)
  Top 0.152: v9.4,54.61 11.94,57.15 v17.78,57.15
  Bottom 0.152: J1.6 6.33,51.55 v9.4,54.61 | v17.78,57.15 18.86,56.07 U$31.12
EDC  (via drill 0.25)
  Top 0.152: v9.4,55.88 11.18,57.66 18.54,57.66 v19.3,56.9
  Bottom 0.152: J1.7 6.06,52.55 v9.4,55.88 | v19.3,56.9 19.36,56.84 U$31.11
ERST  (via drill 0.25)
  Top 0.152: v19.56,53.59 19.56,32.36 24.31,27.61 26.01,27.61 v26.16,27.46
  Bottom 0.152: U$31.10 19.86,53.9 v19.56,53.59 | U2.22 27.18,28.48 v26.16,27.46
GDR  (via drill 0.3)
  Top 0.152: v23.88,56.13 v23.88,67.06
  Bottom 0.152: Q1.1 26.35,73.34 23.88,70.87 v23.88,67.06 | U$31.2 23.86,56.12 v23.88,56.13
GND  (via drill 0.25)
  Bottom 0.254: J3.8 9.35,63.47 9.86,62.96 R11.9
  other vias: 27.43,31.24 26.67,31.24 28.19,31.24 21.08,32 51.56,32.26 45.97,32.26 43.18,32.26 21.59,4.83 11.43,1.78 13.46,27.69 7.37,31.5 16.51,12.7 11.94,41.91 17.53,41.91 30.48,73.41 27.69,68.07 20.83,56.9 28.96,25.4 35.56,19.81 40.64,14.22 26.44,28.42 14.99,55.88
  pour Bottom (rank 6): 55.37,0 55.37,76.2 0,76.2 0,0
  pour Top: 54.86,-0.02 54.86,76.2 0,76.2 -0.49,-0.02
HINGE  (via drill 0.25)
  Top 0.152: v18.8,38.1 8.38,48.51 v8.38,57.91 | v23.6,30.99 20.93,33.66 20.93,34.01 20.34,34.6 v20.34,35.56
  Bottom 0.152: v8.38,57.91 8.38,59.41 R11.1 | v18.8,38.1 18.8,37.97 20.34,36.42 v20.34,35.56 | U2.3 v23.6,30.99
INTERRUPT
  Bottom 0.152: U2.7 18.51,33.24 SJ1.1
LIGHTSENSOR
  Bottom 0.152: U3.1_E 24.51,2.54 | 24.51,2.54 R18.2 | U2.2 24.9,30.49 24.51,30.1 24.51,4.06 24.51,4.04 24.51,2.54
MICBIAS
  Bottom 0.152: U2.6 24.25,32.49 24.01,32.73 23.61,32.73 22.31,31.43 22.31,27.51 18.03,23.23 R9.1
MICBTN  (via drill 0.25)
  Top 0.152: v25.15,29.44 v23.88,29.44
  Bottom 0.152: J2.1 8.34,2.25 10.92,4.83 18.03,4.83 19.81,6.6 19.81,13.72 18.86,14.67 R10.1 R9.2 18.8,16.58 23.37,21.15 23.37,28.93 v23.88,29.44 | v25.15,29.44 25.43,29.73 U2.1
MOSI  (via drill 0.25)
  Top 0.152: v16.26,50.55 17.74,52.03 v17.74,53.3
  Bottom 0.152: U$31.14 17.86,53.42 v17.74,53.3 | J1.5 8.78,50.55 9.06,50.26 15.97,50.26 v16.26,50.55
N$1
  Bottom 0.152: R8.2 13.46,25.15 | 13.46,25.15 R7.2 | C16.1 13.46,25.15
N$2
  Bottom 0.305: C5.2 28.51,64.76 27.61,65.66 D2.C 28.12,66.8 30.66,69.34 D1.A
N$3
  Bottom 0.305: L1.P$2 31.31,57.5 D3.A 30.41,62.11 30.41,63.75 | 30.41,63.75 C5.1 | Q1.3 26.84,72.39 26.16,71.71 26.16,64.26 27.69,62.74 29.4,62.74 30.41,63.75
N$4  (via drill 0.3)
  Top 0.305: LED1.C 52.42,64.52 v51.31,64.52
  Bottom 0.305: v51.31,64.52 51.24,64.45 R13.2
N$5
  Bottom 0.152: R11.16 9.62,59.46 9.12,59.96 R11.2 8.43,59.97 J3.1
N$6
  Bottom 0.152: R11.15 9.63,59.96 9.13,60.46 R11.3 8.43,60.47 J3.2
N$7
  Bottom 0.152: LED.A 16.26,3.62 R3.2
N$8
  Bottom 0.152: R11.14 9.64,60.46 9.14,60.96 R11.4 8.43,60.97 J3.3
N$9
  Bottom 0.152: R11.13 9.65,60.96 9.15,61.46 R11.5 8.43,61.47 J3.4
N$10
  Bottom 0.152: R11.12 9.66,61.46 9.16,61.96 R11.6 8.43,61.97 J3.5
N$11
  Bottom 0.152: J3.6 8.43,62.47 R11.7 9.16,62.46 9.66,61.96 R11.11
N$12
  Bottom 0.152: J3.7 8.43,62.97 R11.8 9.17,62.96 9.67,62.46 R11.10
N$13
  Bottom 0.152: SP2.+ 26.74,38.94 25.9,38.1 Q3.3 25.22,37.68 D6.A
N$14  (via drill 0.3)
  Top 0.305: LED2.C 52.42,51.82 v51.31,51.82
  Bottom 0.305: v51.31,51.82 51.24,51.75 R14.2
N$15  (via drill 0.3)
  Top 0.305: LED3.C 52.42,39.12 v51.31,39.12
  Bottom 0.305: v51.31,39.12 51.31,40.13 50.36,41.08 R15.2
N$16  (via drill 0.3)
  Top 0.305: LED4.C 52.42,26.42 v51.31,26.42
  Bottom 0.305: v51.31,26.42 51.24,26.35 R16.2
N$18  (via drill 0.3)
  Top 0.305: LED5.C 52.42,13.72 v51.31,13.72
  Bottom 0.305: v51.31,13.72 51.24,13.65 R17.2
PA27  (via drill 0.25)
  Top 0.152: v30.48,30.23 22.35,22.1 v22.35,8.13
  Bottom 0.152: U2.17 30.21,30.49 v30.48,30.23 | v22.35,8.13 22.35,8.06 R3.1
PREVGH
  Bottom 0.152: C11.1 17.23,51.09 14.36,53.96 U$31.21
  Bottom 0.254: U$31.21 14.36,56.78 18.8,61.21 D3.C
PREVGL  (via drill 0.25)
  Top 0.254: v30.23,65.53 27.94,63.25 v24.89,63.25
  Bottom 0.152: C13.1 13.36,52 U$31.23
  Bottom 0.254: D2.A 31.31,66.62 v30.23,65.53 | v24.89,63.25 18.54,63.25 13.36,58.06 U$31.23
READINGLIGHT  (via drill 0.25)
  Top 0.152: v23.81,32.24 22.61,33.45 22.61,38.61 v34.29,50.29
  Bottom 0.152: U2.5 24.06,31.99 v23.81,32.24 | v34.29,50.29 36.9,52.9 R12.2 Q2.1
READINGLIGHT_SINK
  Bottom 0.305: R13.1 48.51,61.03 48.51,53.85 | 48.51,53.85 48.51,51.37 R14.1 49.51,49.33 49.51,42.63 48.51,41.63 48.51,40.71 R15.1 48.51,37.66 48.51,25.97 R16.1 48.51,22.93 48.51,13.21 49.97,11.75 R17.1 | Q2.3 48.51,53.85
RESE  (via drill 0.3)
  Top 0.152: v27.18,71.12 23.37,67.31 v23.37,56.9
  Bottom 0.152: v27.18,71.12 27.5,71.44 Q1.2 31.9,71.44 R1.1 | v23.37,56.9 U$31.3
RTCINT  (via drill 0.25)
  Top 0.152: v31.24,29.46 31.22,29.49 31.22,31.27 28.27,34.21 v26.75,34.21
  Bottom 0.152: U4.7 42.55,17.91 31.24,29.21 v31.24,29.46 | v26.75,34.21 26.68,34.14 U2.8
SCK  (via drill 0.25)
  Top 0.152: v18.8,50.55 18.8,52.96 v18.41,53.34
  Bottom 0.152: v18.8,50.55 18.07,49.82 9.06,49.82 8.79,49.55 J1.4 | v18.41,53.34 18.36,53.4 U$31.13
SCL  (via drill 0.25)
  Top 0.152: v7.37,46.99 8.38,46.99 v18.29,37.08 | v20.45,33.78 20.45,33.4 23.37,30.48 29.97,30.48 30.48,30.99 v30.73,30.99
  Bottom 0.152: J1.2 6.81,47.55 v7.37,46.99 | U2.16 v30.73,30.99 42.55,19.18 U4.6 | v18.29,37.08 18.29,35.94 v20.45,33.78
SDA  (via drill 0.25)
  Top 0.152: v30.25,31.5 30,31.75 29.46,31.75 26.42,31.75 25.45,30.79 24.59,30.79 21.84,33.53 v21.84,33.78 | v19.05,36.96 19.05,37.08 8.13,48.01 v7.37,48.01
  Bottom 0.152: J1.3 6.83,48.55 v7.37,48.01 | U2.15 v30.25,31.5 30.91,31.5 41.96,20.45 U4.5 | v21.84,33.78 21.19,33.78 19.05,35.92 v19.05,36.96
SWCLK  (via drill 0.25)
  Top 0.152: v29.21,28.19 v37.08,28.19
  Bottom 0.152: U2.19 28.68,28.72 v29.21,28.19 | R2.2 38.17,29.28 v37.08,28.19 37.34,28.45 TP4.P$1
SWDIO  (via drill 0.25)
  Top 0.152: v29.72,27.18 35.56,27.18 v35.81,27.43
  Bottom 0.152: U2.20 28.18,28.54 29.54,27.18 v29.72,27.18 | v35.81,27.43 35.81,33.27 38.61,36.07 TP1.P$1
TINT
  Bottom 0.152: U$31.26 45.86,45.25 44.07,47.04 40.26,47.04 36.22,43 36.22,40.38 31.12,35.28 28.88,35.28 27.18,33.58 U2.9
TRST
  Bottom 0.152: U$31.27 45.36,45.06 43.69,46.74 40.39,46.74 36.52,42.87 36.52,40.26 31.24,34.98 29.01,34.98 27.68,33.65 U2.10
TSCL
  Bottom 0.152: U$31.30 43.86,45.45 43.18,46.13 40.64,46.13 37.13,42.62 37.13,39.93 31.57,34.37 29.26,34.37 28.68,33.79 U2.12
TSDA
  Bottom 0.152: U$31.29 44.36,45.45 43.38,46.43 40.51,46.43 36.83,42.75 36.83,40.13 31.37,34.67 29.14,34.67 28.18,33.72 U2.11
V+  (via drill 0.3)
  Top 0.305: v3.3,53.85 3.3,42.16 v7.11,38.35
  Bottom 0.305: J1.9 4,54.55 v3.3,53.85 | v7.11,38.35 7.3,38.17 C1.1 8.96,38.17 10.99,40.2 U1.1 10.99,39.81 11.43,39.37 12.45,39.37 12.89,39.81 U1.3
VBACKUP
  Bottom 0.152: U4.3 39.5,19.18 40.64,18.03 40.64,16.35 | B1.+$1 32.41,8.13 40.64,16.35 | B1.+$2 48.87,8.13 40.64,16.35
VCOM
  Bottom 0.152: U$31.24 12.86,53.88 10.07,51.09 C14.2
VDD
  Bottom 0.152: U$31.18 15.86,53.48 17.02,52.32 21.12,52.32 22.35,51.09 C9.2
VGH
  Bottom 0.152: U$31.5 22.36,54.21 23.48,53.09 23.69,53.09 24.86,51.92 26.75,51.92 27.58,51.09 C7.2
VGL
  Bottom 0.152: U$31.4 22.86,54.21 23.68,53.39 23.82,53.39 24.99,52.22 28.99,52.22 30.12,51.09 C6.2
VSH
  Bottom 0.152: U$31.20 14.86,53.98 16.92,51.92 19.13,51.92 19.96,51.09 C10.2
VSL
  Bottom 0.152: U$31.22 13.86,51.96 14.73,51.09 C12.2
XIN_RTC
  Bottom 0.152: U4.1 37.91,16.51 35.74,16.51 X1.P$2
XOUT_RTC
  Bottom 0.152: X1.P$1 35.74,18.03 37.91,18.03 U4.2

### Text on the board
tPlace: JLCJLCJLCJLC
bPlace: HINGE? | LOL IDK. / Voltage div- / ider. Maybe for / like a flex PCB / for mainboard / to see / hinge / angle. | The buzzer / bit is from / Adafruit's / CC-BY Bon- / sai Buckaroo. / This design is / CC-BY-SA 4.0 / (except the bear!) | TINY BOOK / second screen / by joey castillo / @josecastillo | OSO-TIBO-B2-00 | V+ | GND | DC | CS | MOSI | SCK | SDA | SCL | 2.7" E-PAPER DISPLAY | AUDIO/INT | NOTE: / firmware doesn't / yet support this; / recommend non- / touchscreen / display. | MOSI, SCK CS and DC / come in over 9-pin. / Reset is Seesaw 25, / Busy is Seesaw 24. | 9-PIN CONNECTOR | POWER / SUPPLY | But: I2C connects / TS I2C to spare / SAMD09 I2C pins / 14/15. TINT on / Seesaw 10, / TRST on 11. | TOUCHSCREEN? | HEADPHONE JACK | pin / 5 | SWDIO | Mono output from the audio / signal on the 9-pin connector. | GND | Close SJ1 to use | that pin / for the / Seesaw / interrupt | 3V3 | SWCLK | instead. (or / in addition?) | RESET | BUZZER | using Adafruit's / Seesaw firmware to / add mas GPIO / & additional / features. | SAMD09 MCU | PROGRAMMING / INTERFACE | INLINE / BUTTON / BIAS | REAL-TIME CLOCK | No mic input, but / you can read an / inline button on / Seesaw 2: set / Seesaw 7 high to | PCF8523 RTC on main I2C bus. | RTC interrupt can / be read on / Seesaw / pin 9. | bias the / mic, then / detect a / tap when | Backup battery: / CR1220 | Seesaw / pin 7 | the signal / falls to / ground (or / some other / level in / between) | Five white LEDs, PWM'able on Seesaw pin 6. (Note: PWM dims all LED's at once). | FLASHLIGHT / NIGHTLIGHT / READING LIGHT | LED on / Seesaw 27 | STATUS | Because why not? / Read light value on / Seesaw pin 3 ADC. | PHOTO- / TRANSISTOR